# Altium schematic sheet Sheet2.SchDoc
size A4
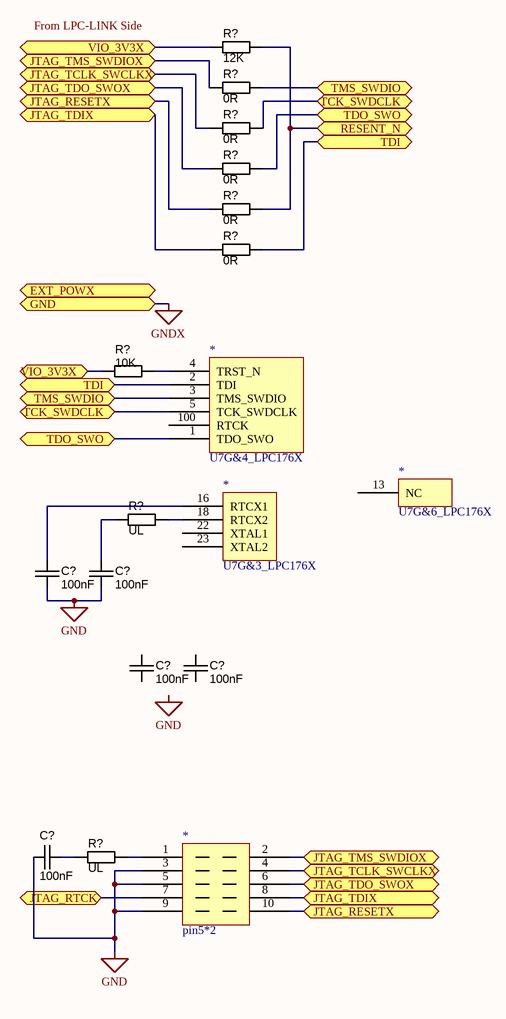
[diagram p0: Sheet2.SchDoc]

## Parts
(Parts that share a designator on the sheet are numbered #1, #2 ... from top to bottom, then left to right.)
*#1  U7G&4_LPC176X
*#2  U7G&6_LPC176X
*#3  U7G&3_LPC176X
*#4  pin5*2
C?#1  value 100nF  [CAPC2012N]  (hidden comment: approved sub OK)
C?#2  value 100nF  [CAPC2012N]  (hidden comment: approved sub OK)
C?#3  value 100nF  [CAPC2012N]  (hidden comment: approved sub OK)
C?#4  value 100nF  [CAPC2012N]  (hidden comment: approved sub OK)
C?#5  value 100nF  [CAPC2012N]  (hidden comment: approved sub OK)
R?#1  value 12K  [RESC1005N]  (hidden comment: Thick Film)
R?#2  value 0R  [RESC1005N]  (hidden comment: Thick Film)
R?#3  value 0R  [RESC1005N]  (hidden comment: Thick Film)
R?#4  value 0R  [RESC1005N]  (hidden comment: Thick Film)
R?#5  value 0R  [RESC1005N]  (hidden comment: Thick Film)
R?#6  value 0R  [RESC1005N]  (hidden comment: Thick Film)
R?#7  value 10K  [RESC1005N]  (hidden comment: Thick Film)
R?#8  value UL  [RESC2012N]  (hidden comment: Thick Film)
R?#9  value UL  [RESC2012N]  (hidden comment: Thick Film)

## Ports
EXT_POWX, GND, JTAG_RESETX, JTAG_RTCK, JTAG_TCLK_SWCLKX, JTAG_TDIX, JTAG_TDO_SWOX, JTAG_TMS_SWDIOX, RESENT_N, TCK_SWDCLK, TDI, TDO_SWO, TMS_SWDIO, VIO_3V3X

## Nets
GND: *#4.3 *#4.5 *#4.9 C?#1.1 C?#2.1 C?#5.1
GNDX: port GND
JTAG_RESETX: *#4.10 R?#5.1 ; port JTAG_RESETX
JTAG_RTCK: *#4.7 ; port JTAG_RTCK
JTAG_TCLK_SWCLKX: *#4.4 R?#3.1 ; port JTAG_TCLK_SWCLKX
JTAG_TDIX: *#4.8 R?#6.1 ; port JTAG_TDIX
JTAG_TDO_SWOX: *#4.6 R?#4.1 ; port JTAG_TDO_SWOX
JTAG_TMS_SWDIOX: *#4.2 R?#2.1 ; port JTAG_TMS_SWDIOX
RESENT_N: R?#1.2 R?#5.2 ; port RESENT_N
TCK_SWDCLK: *#1.5(TCK_SWDCLK) R?#3.2 ; port TCK_SWDCLK
TDI: *#1.2(TDI) R?#6.2 ; port TDI
TDO_SWO: *#1.1(TDO_SWO) R?#4.2 ; port TDO_SWO
TMS_SWDIO: *#1.3(TMS_SWDIO) R?#2.2 ; port TMS_SWDIO
VIO_3V3X: R?#1.1 R?#7.1 ; port VIO_3V3X
Net*#1_4: *#1.4(TRST_N) R?#7.2
Net*#3_16: *#3.16(RTCX1) C?#1.2
Net*#3_18: *#3.18(RTCX2) R?#8.1
Net*#4_1: *#4.1 R?#9.1
NetC?#2_2: C?#2.2 R?#8.2
NetC?#5_2: C?#5.2 R?#9.2

Not connected (* = marked no-connect by the designer): *#1 100(RTCK); *#2 13(NC); *#3 22(XTAL1) 23(XTAL2); C?#3 1 2; C?#4 1 2

## Notes on the sheet
- Labels drawn without touching a wire or pin: From LPC-LINK Side, GND

## Library data of the parts
C?#1-C?#5 = CAPC_100n_0805: Capacitor SMD Cer 100nF 10% 50V X7R 0805; Manufacturer 1: Kemet; Manufacturer Part Number 1: C0805C104K5RACTU; Tolerance: ?0%; Ratings: 50V; X7R; Material: ceramic; Package / Case: 0805 (2012 metric); Supplier 1: Digi-Key; Supplier Part Number 1: 399-1170-1-ND
R?#1-R?#7 = RES_330R_0402_5%: Resistor SMD chip 330 Ohm 0.063W 5% 0402; Manufacturer 1: Yageo; Manufacturer Part Number 1: RC0402JR-07330RL; Ratings: 1/16 W; Tolerance: ?%; Package / Case: 0402 (1005 Metric); Supplier 1: Digi-Key; Supplier Part Number 1: 311-330JRCT-ND; ComponentLink1URL: http://www.yageo.com/documents/recent/PYu-RC0402_51_RoHS_L_6.pdf; ComponentLink1Description: http://www.yageo.com/documents/recent/PYu-RC0402_51_RoHS_L_6.pdf
R?#8 R?#9 = RES_10K_0805_5%: Resistor SMD chip 10k Ohm 0.125W 5% 0805; Manufacturer 1: Yageo; Manufacturer Part Number 1: RC0805JR-0710KL; Ratings: 1/8 W; Tolerance: ?%; Package / Case: 0805 (2012 metric); Material: Thick Film; Supplier 1: Digi-Key; Supplier Part Number 1: 311-10KARCT-ND